# Altium schematic sheet Sheet1.SchDoc: Arco Inteligente
size A4; Author: Adolfo de Souza Serique; Organization: Agym; Address1: Nossa Senhora do Pópulo; Address2: Caldas da Rainha; Address3: Portugal; DocumentNumber: 01; Revision: 00; SheetNumber: 01; SheetTotal: 01
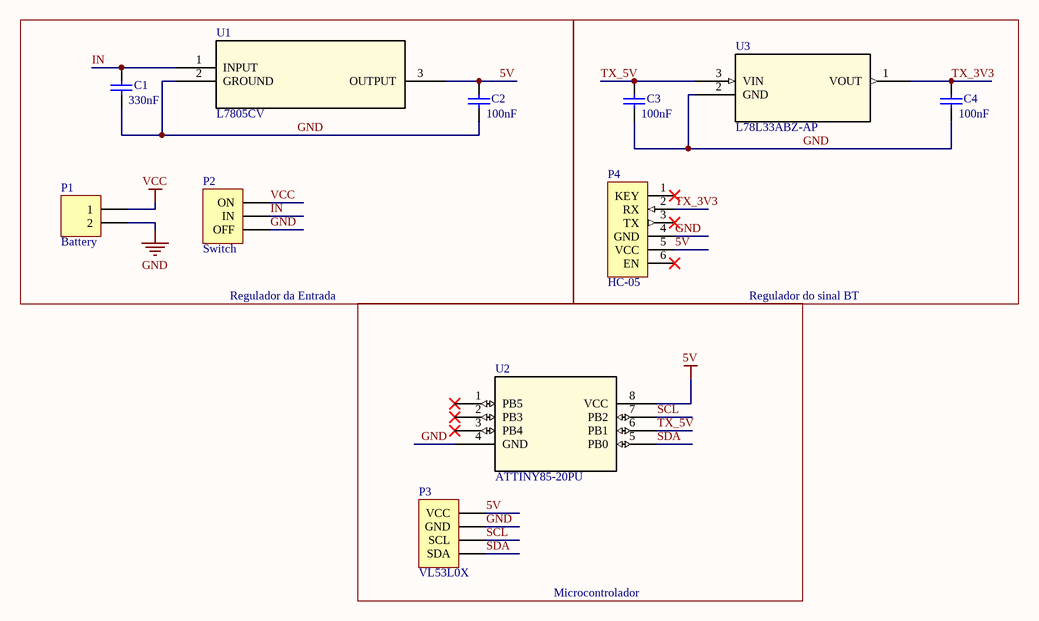
[diagram p0: Sheet1.SchDoc]

## Parts
C1  value 330nF  [RAD-0.3]  (hidden comment: Cap)
C2  value 100nF  [RAD-0.3]  (hidden comment: Cap)
C3  value 100nF  [RAD-0.2]  (hidden comment: Capacitor)
C4  value 100nF  [RAD-0.2]  (hidden comment: Capacitor)
P1  Battery  [HDR1X2]
P2  Switch  [HDR1X3]
P3  VL53L0X  [HDR1X4]
P4  HC-05  [HDR1X6]
U1  L7805CV  [TO-220_STM]
U2  ATTINY85-20PU  [8P3_ATM]
U3  L78L33ABZ-AP  [TO-92-TR_STM]

## Blocks framed on the sheet
Regulador da Entrada: C1 C2 P1 P2 U1
Regulador do sinal BT: C3 C4 P4 U3
Microcontrolador: P3 U2

## Nets
5V: C2.2 P3.1(VCC) P4.5(VCC) U1.3(OUTPUT) U2.8(VCC)
GND: C1.1 C2.1 C3.1 C4.1 P1.2 P2.3(OFF) P3.2(GND) P4.4(GND) U1.2(GROUND) U2.4(GND) U3.2(GND)
VCC: P1.1 P2.1(ON)
IN: C1.2 P2.2(IN) U1.1(INPUT)
SCL: P3.3(SCL) U2.7(PB2)
SDA: P3.4(SDA) U2.5(PB0)
TX_3V3: C4.2 P4.2(RX) U3.1(VOUT)
TX_5V: C3.2 U2.6(PB1) U3.3(VIN)

Not connected (* = marked no-connect by the designer): P4 1(KEY)* 3(TX)* 6(EN)*; U2 1(PB5)* 2(PB3)* 3(PB4)*

## Notes on the sheet
- Author
- Title
- Size:
- A4
- Number:
- Revision:
- Date:
- Sheet
- of

## Library data of the parts
C1 C2 = Cap: Capacitor; Published: 8-Jun-2000; LatestRevisionDate: 17-Jul-2002; LatestRevisionNote: Re-released for DXP Platform.; PackageReference: RAD-0.3; Publisher: Altium Limited; PackageDescription: Radial Cap, Thru-Hole; 2 Leads; 0.3 in Pin Spacing
C3 C4 = C: Manufacturer: *; PartNumber: *; Package Type: *
P1 = Header 2: Header, 2-Pin; LatestRevisionDate: 17-Jul-2002; LatestRevisionNote: Re-released for DXP Platform.; Publisher: Altium Limited
P2 = Header 3: Header, 3-Pin; LatestRevisionDate: 17-Jul-2002; LatestRevisionNote: Re-released for DXP Platform.; Publisher: Altium Limited
P3 = Header 4: Header, 4-Pin; LatestRevisionDate: 17-Jul-2002; LatestRevisionNote: Re-released for DXP Platform.; Publisher: Altium Limited
P4 = Header 6: Header, 6-Pin; LatestRevisionDate: 17-Jul-2002; LatestRevisionNote: Re-released for DXP Platform.; Publisher: Altium Limited
U1 = L7805CV: No Description Available; Mfr_Name: STMicroelectronics; Copyright: Copyright (C) 2021 Ultra Librarian. All rights reserved.; Manufacturer_Part_Number: L7805CV; RefDes: RefDes; Type: DEV
U2 = ATTINY85-20PU: No Description Available; Mfr_Name: Microchip; Copyright: Copyright (C) 2021 Ultra Librarian. All rights reserved.; Manufacturer_Part_Number: ATTINY85-20PU; RefDes: RefDes; Type: DEV
U3 = L78L33ABZ-AP: No Description Available; Mfr_Name: STMicroelectronics; Copyright: Copyright (C) 2021 Ultra Librarian. All rights reserved.; Manufacturer_Part_Number: L78L33ABZ-AP; RefDes: RefDes; Type: DEV